# Altium schematic sheet DEP_REVC_0.SchDoc: 2021 Deployment REVB
size 270 x 223 mm; SheetTotal: 3; Origin: Eagle; Date: 2022-10-06 6:10:24 PM; SheetNumber: 2; GateName_1: G$1; SymbolName_1: LETTER_L; LibraryName: frames; DeviceSetName: LETTER_L; GateName_2: G$2; SymbolName_2: DOCFIELD; Sheet: Sheet:; REV: REV:
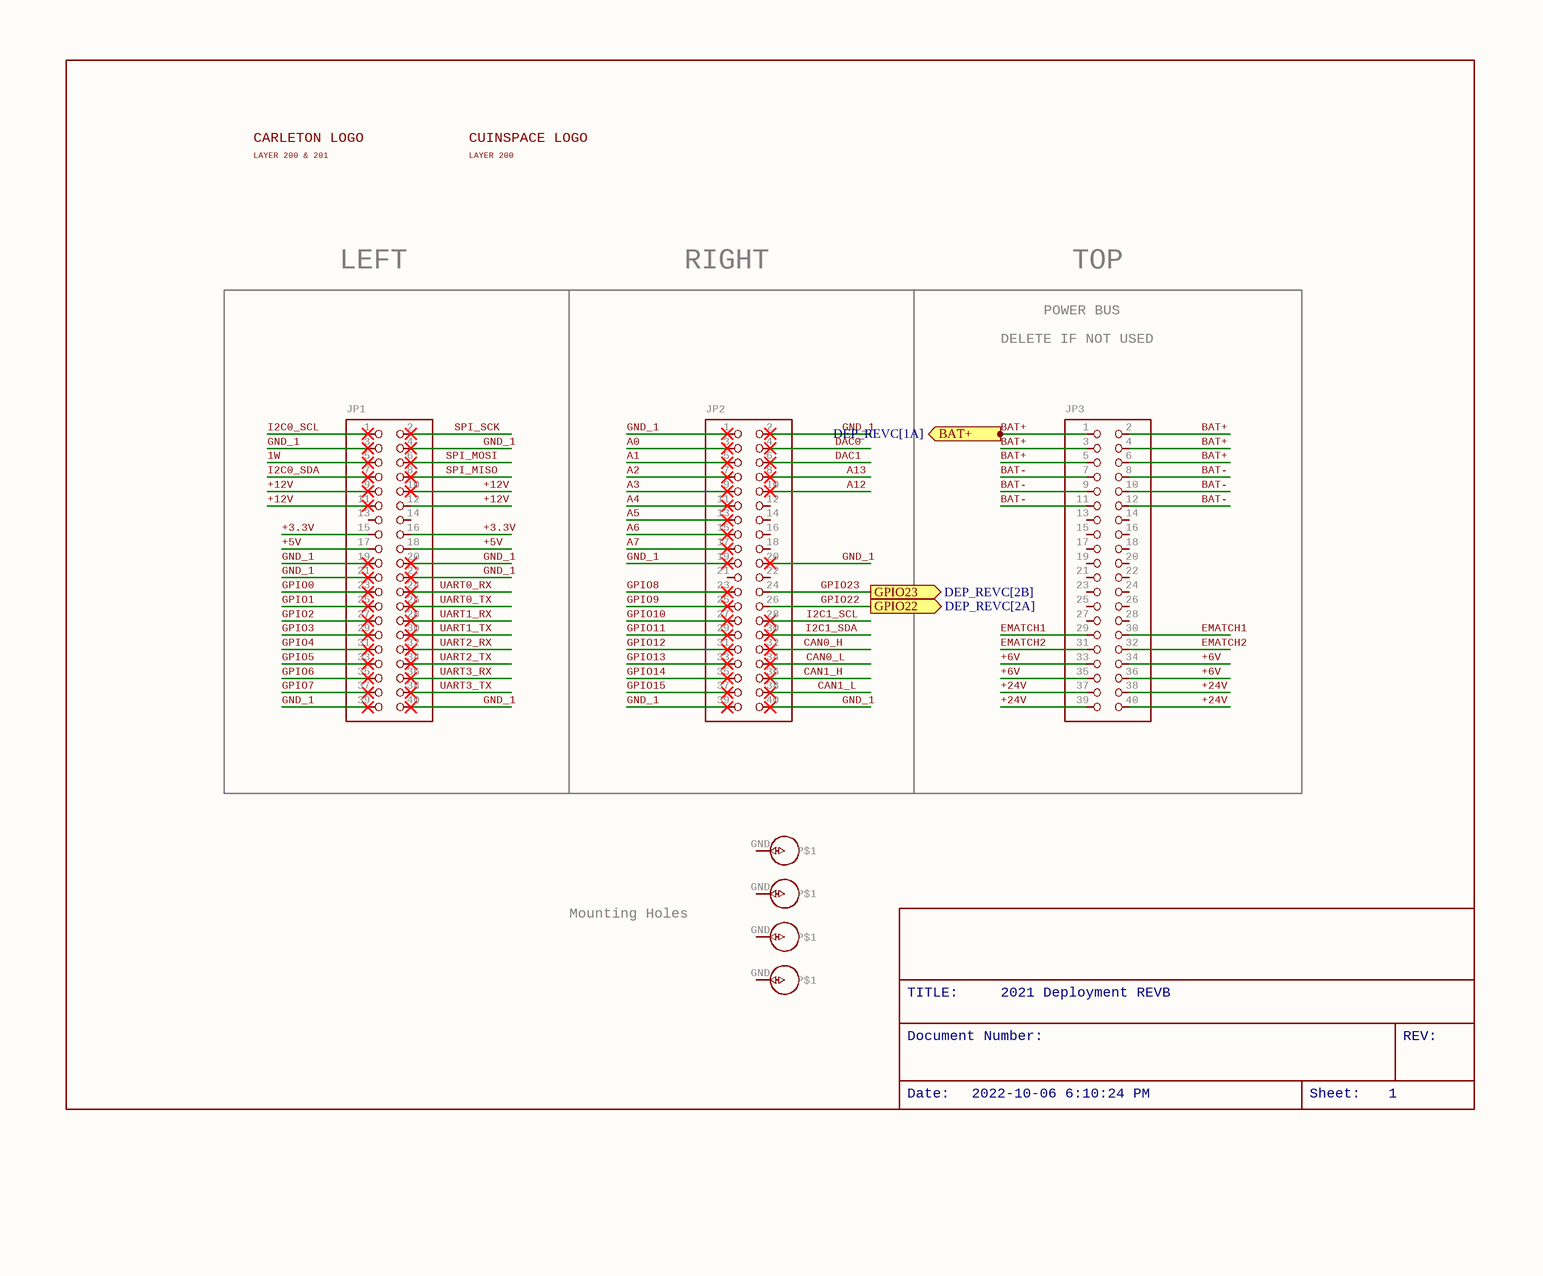
[diagram p0: DEP_REVC_0.SchDoc]

## Parts
$$U$1  PS/104-MOUNTING-HOLE  [PC/104-MOUNTING-HOLE]  (value not drawn)
JP1  PINHD-2X20  [2X20]  (value not drawn)
JP2  PINHD-2X20  [2X20]  (value not drawn)
JP3  PINHD-2X20  [2X20]  (value not drawn)
U$1  PS/104-MOUNTING-HOLE  [PC/104-MOUNTING-HOLE]  (value not drawn)
U$2  PS/104-MOUNTING-HOLE  [PC/104-MOUNTING-HOLE]  (value not drawn)
U$3  PS/104-MOUNTING-HOLE  [PC/104-MOUNTING-HOLE]  (value not drawn)
U$4  CARLETONLOGO: CARLETON LOGO  LAYER200&201: LAYER 200 & 201  [CARLETONU_3CM]  (hidden comment: CARLETON3CM)
U$6  CUINSPACELOGO: CUINSPACE LOGO  LAYER200: LAYER 200  [INSPACE_3CM_LETTERS]  (hidden comment: INSPACE3CM_L)

## Ports
BAT+ (out, see DEP_REVC[1A]), GPIO22 (out, see DEP_REVC[2A]), GPIO23 (out, see DEP_REVC[2B])

## Nets
1W: JP1.5
+3.3V: JP1.15 JP1.16
+5V: JP1.17 JP1.18
+6V: JP3.33 JP3.34 JP3.35 JP3.36
+12V: JP1.9 JP1.10 JP1.11 JP1.12
+24V: JP3.37 JP3.38 JP3.39 JP3.40
A0: JP2.3
A1: JP2.5
A2: JP2.7
A3: JP2.9
A4: JP2.11
A5: JP2.13
A6: JP2.15
A7: JP2.17
A12: JP2.10
A13: JP2.8
BAT+: JP3.1 JP3.2 JP3.3 JP3.4 JP3.5 JP3.6 ; port BAT+
BAT-: JP3.7 JP3.8 JP3.9 JP3.10 JP3.11 JP3.12
CAN0_H: JP2.32
CAN0_L: JP2.34
CAN1_H: JP2.36
CAN1_L: JP2.38
DAC0: JP2.4
DAC1: JP2.6
EMATCH1: JP3.29 JP3.30
EMATCH2: JP3.31 JP3.32
GND_1: JP1.3 JP1.4 JP1.19 JP1.20 JP1.21 JP1.22 JP1.39 JP1.40 JP2.1 JP2.2 JP2.19 JP2.20 JP2.39 JP2.40
GPIO0: JP1.23
GPIO1: JP1.25
GPIO2: JP1.27
GPIO3: JP1.29
GPIO4: JP1.31
GPIO5: JP1.33
GPIO6: JP1.35
GPIO7: JP1.37
GPIO8: JP2.23
GPIO9: JP2.25
GPIO10: JP2.27
GPIO11: JP2.29
GPIO12: JP2.31
GPIO13: JP2.33
GPIO14: JP2.35
GPIO15: JP2.37
GPIO22: JP2.26 ; port GPIO22
GPIO23: JP2.24 ; port GPIO23
I2C0_SCL: JP1.1
I2C0_SDA: JP1.7
I2C1_SCL: JP2.28
I2C1_SDA: JP2.30
SPI_MISO: JP1.8
SPI_MOSI: JP1.6
SPI_SCK: JP1.2
UART0_RX: JP1.24
UART0_TX: JP1.26
UART1_RX: JP1.28
UART1_TX: JP1.30
UART2_RX: JP1.32
UART2_TX: JP1.34
UART3_RX: JP1.36
UART3_TX: JP1.38

Not connected (* = marked no-connect by the designer): $$U$1 GND(P$1); JP1 13 14; JP2 12 14 16 18 21 22; JP3 13 14 15 16 17 18 19 20 21 22 23 24 25 26 27 28; U$1 GND(P$1); U$2 GND(P$1); U$3 GND(P$1)

## Notes on the sheet
- LEFT
- RIGHT
- TOP
- DELETE IF NOT USED
- POWER BUS
- Mounting Holes
- TITLE:
- 2021 Deployment REVB
- Document Number:
- REV:
- Date:
- 2022-10-06 6:10:24 PM
- Sheet:
- 1

## Library data of the parts
$$U$1 U$1-U$3 = PS/104-MOUNTING-HOLE: Mounting hole for PC/104 board.; GateName_1: GND; SymbolName_1: PC/104-MOUNTING-HOLE; LibraryName: CU inSpace 2019 Parts; DeviceSetName: PS/104-MOUNTING-HOLE
JP1-JP3 = PINHD-2X20: PIN HEADER; GateName_1: A; SymbolName_1: PINH2X20; POPULARITY: 12; LibraryName: pinhead; DeviceSetName: PINHD-2X20
U$4 = CARLETON3CM: GateName_1: G$1; SymbolName_1: CARLETON_LOGO; DeviceName: 3CM; LibraryName: Logos; DeviceSetName: CARLETON
U$6 = INSPACE3CM_L: GateName_1: G$1; SymbolName_1: INSPACE_LOGO; DeviceName: 3CM_L; LibraryName: Logos; DeviceSetName: INSPACE